# EasyEDA schematic LcsNodes-Extension-GPIO-Board-32-S-B.00.01.json

## Sheets
1 Connectors: TITLE: LcsNodes-Extension-GPIO-Board\nConnectors; REV: B.00.01; Date: 2023-05-06; Sheet: 2/3; Drawn By: helmut-f; Company: Your Company
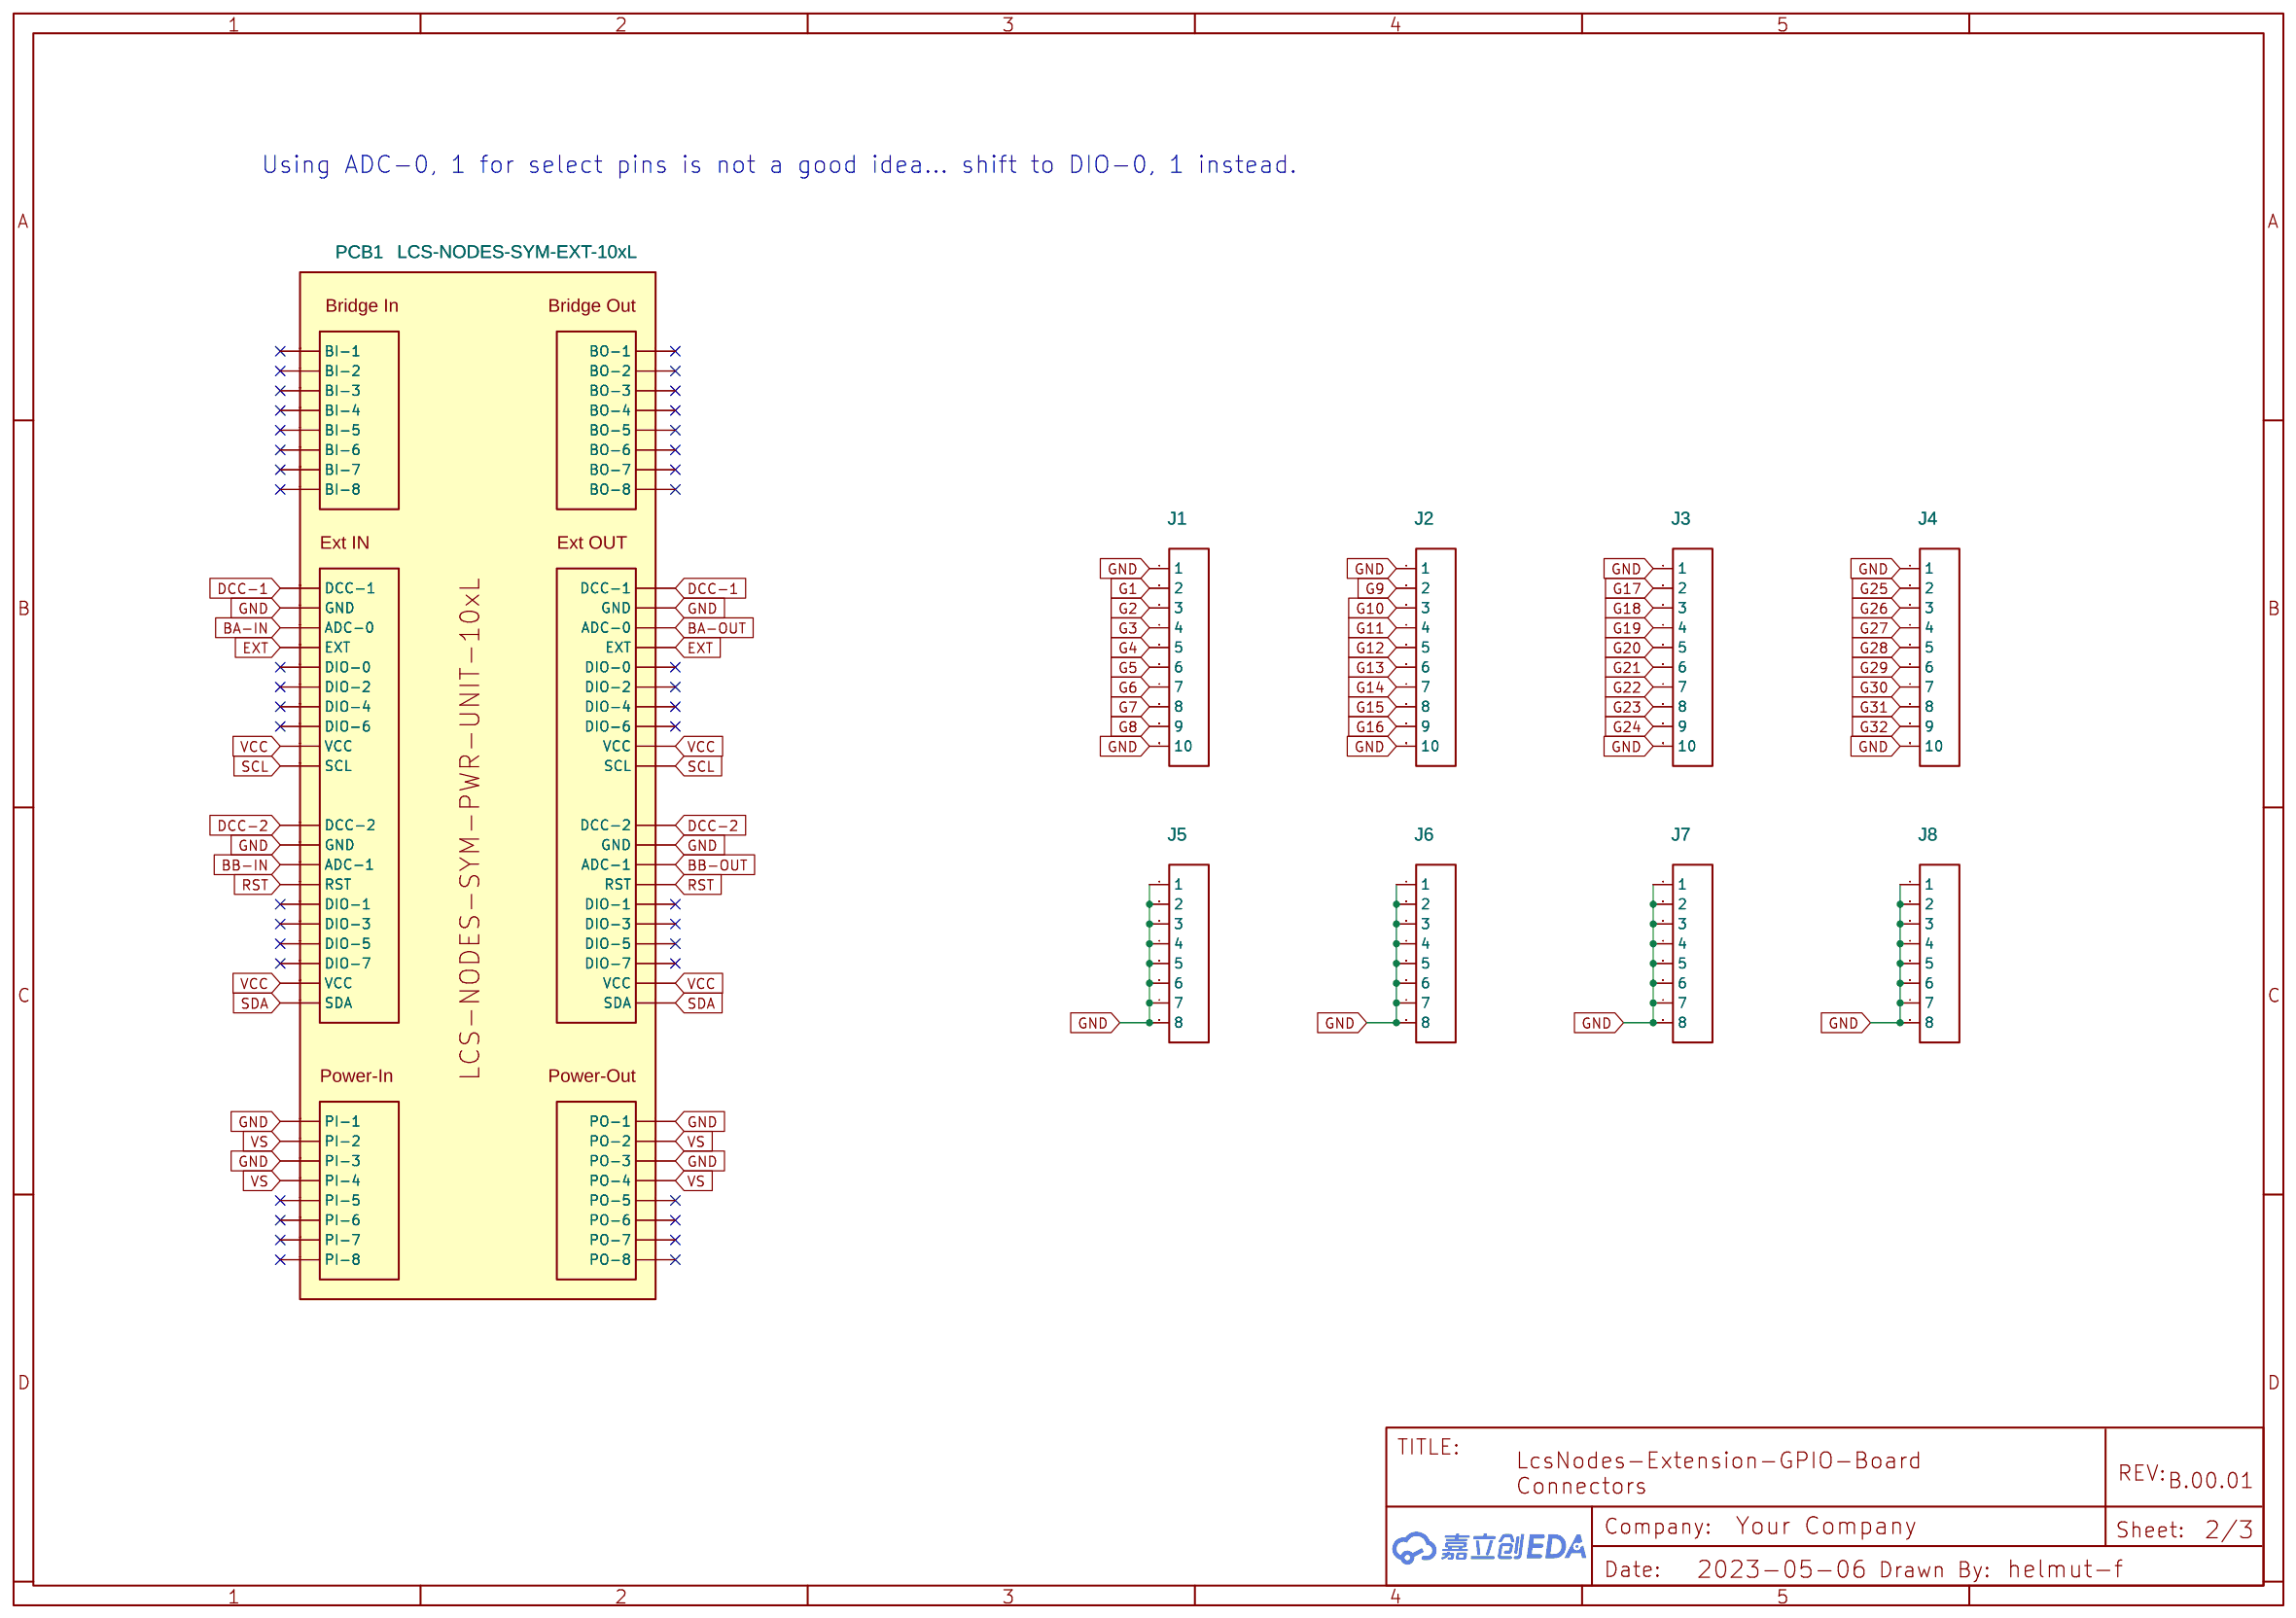
[diagram p0: Connectors]
2 Logic: TITLE: LcsNodes-Extension-GPIO-Board\nLogic; Date: 2023-05-07; Sheet: 3/3
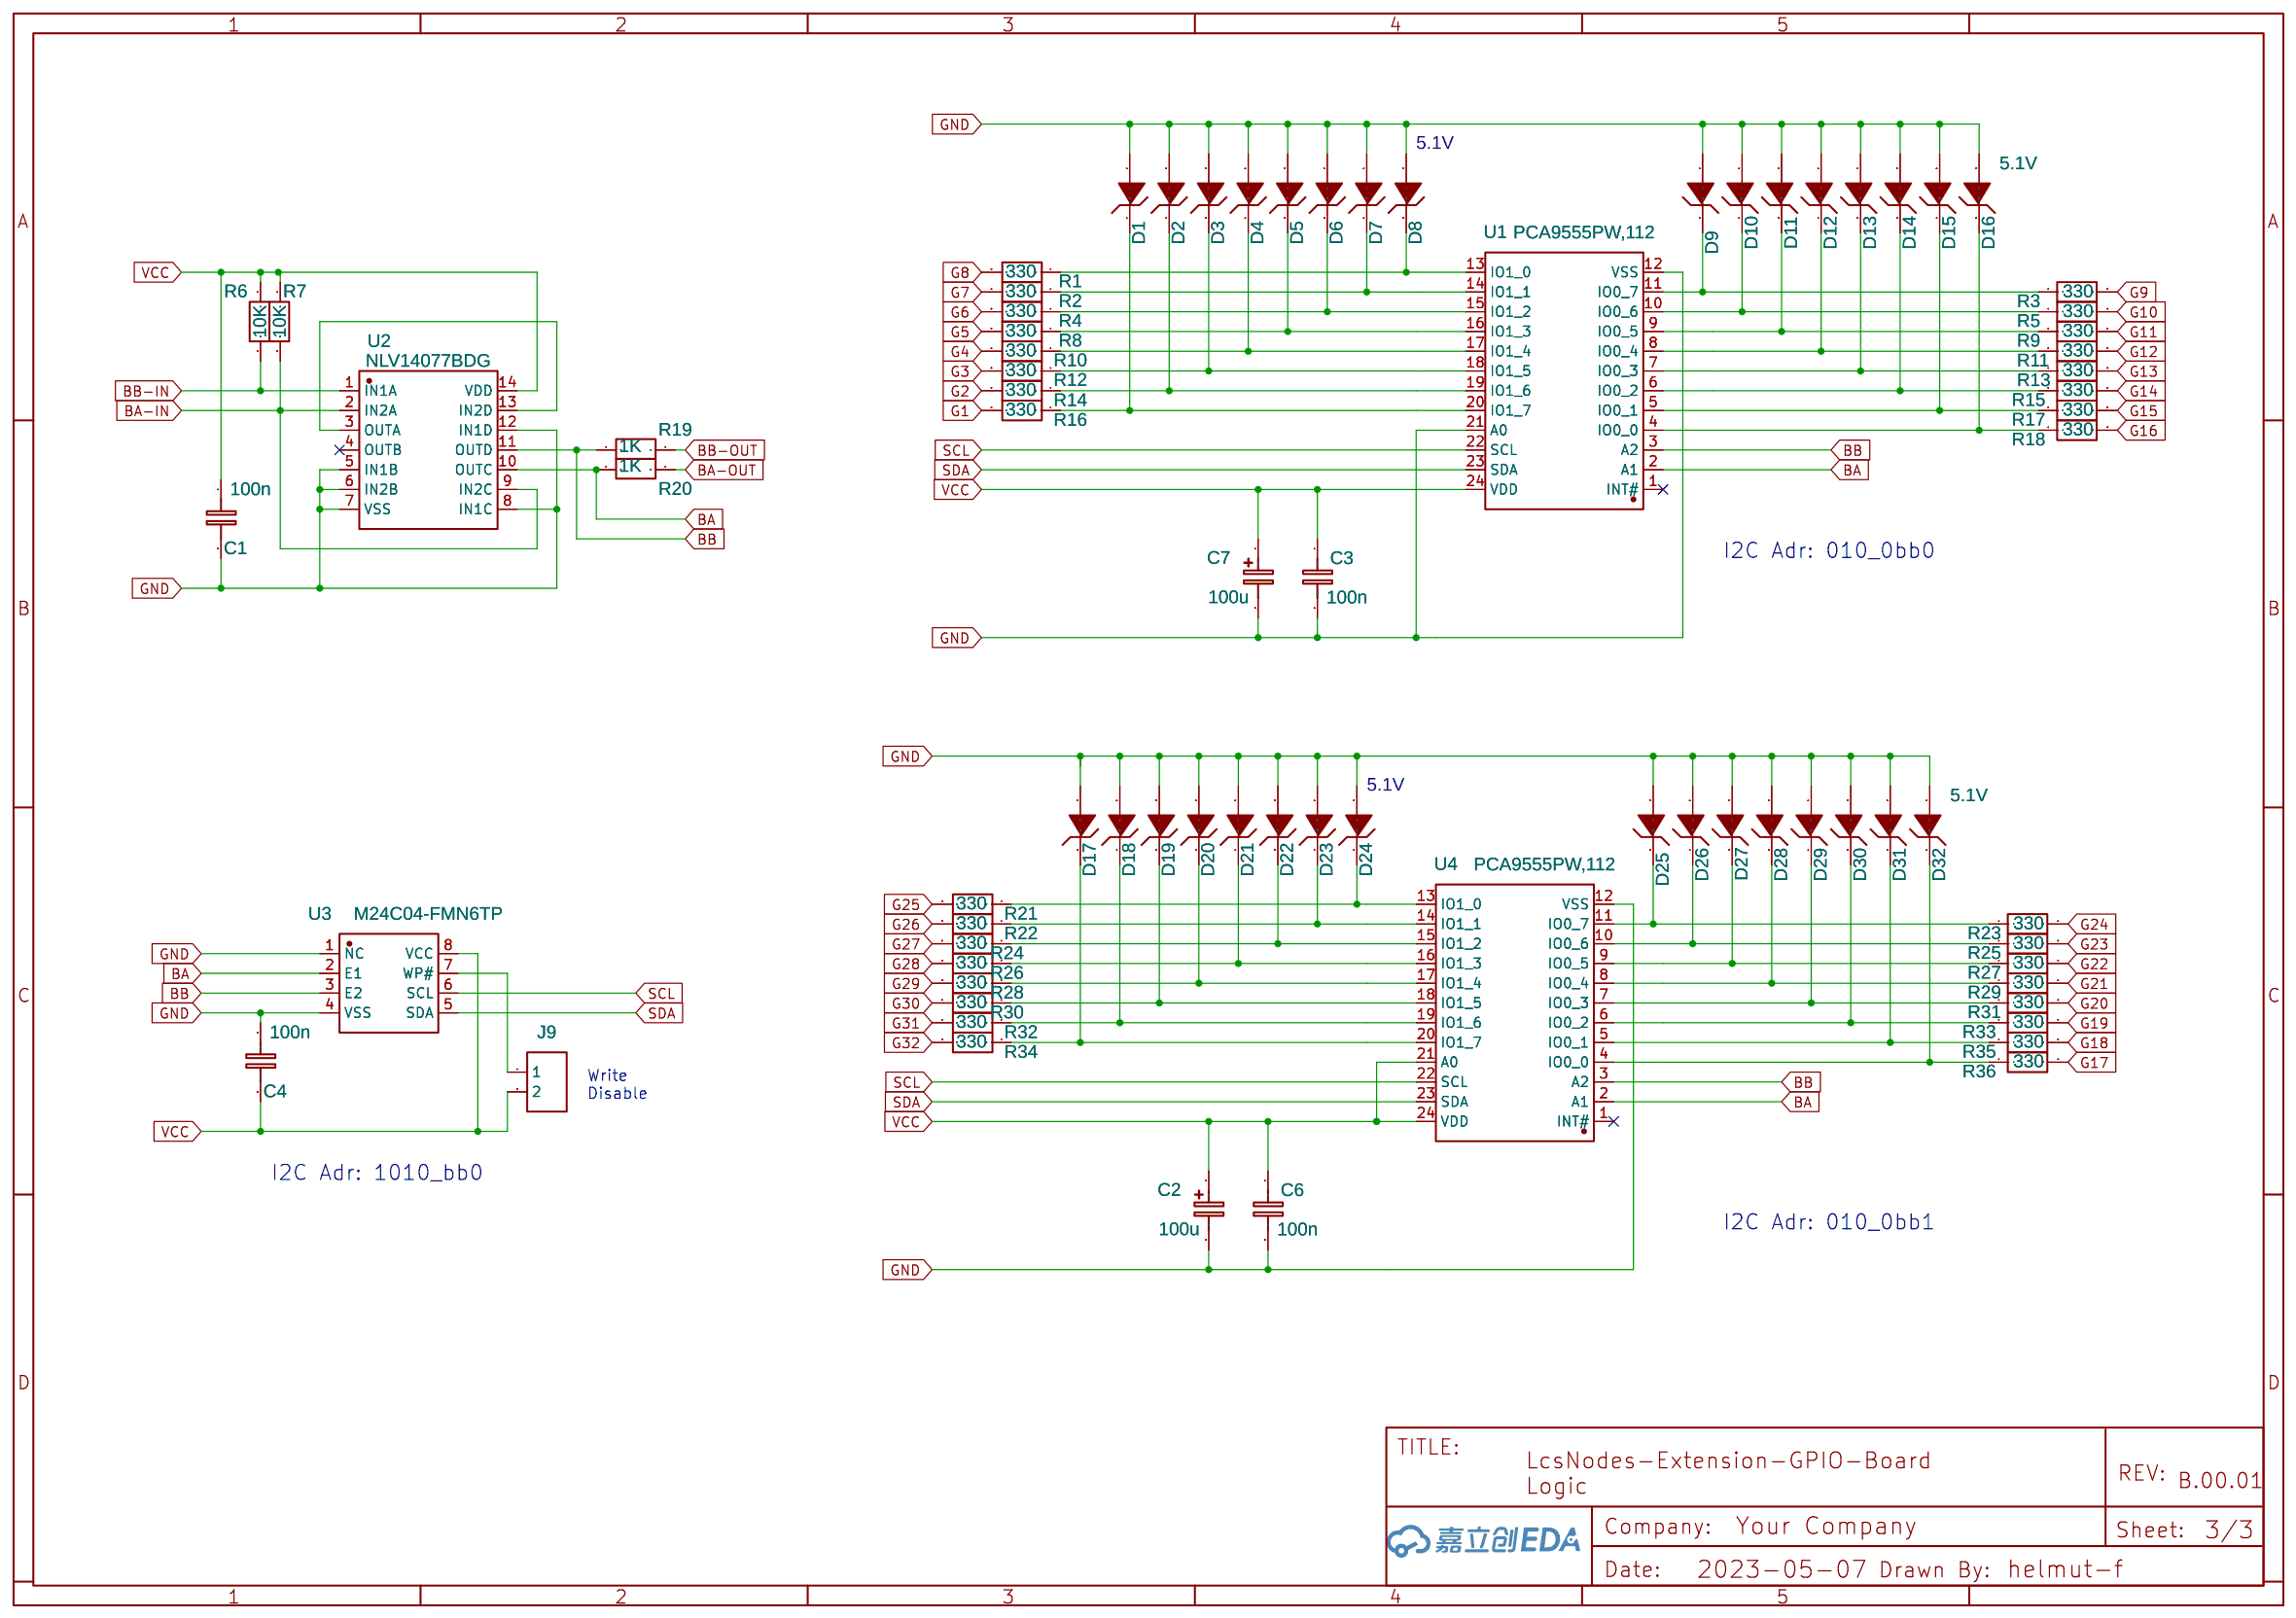
[diagram p1: Logic]
3 High Level Schematic: TITLE: LcsNodes-Extension-GPIO-Board\nHigh Level Schmatic; Date: 2023-02-08; Sheet: 1/3
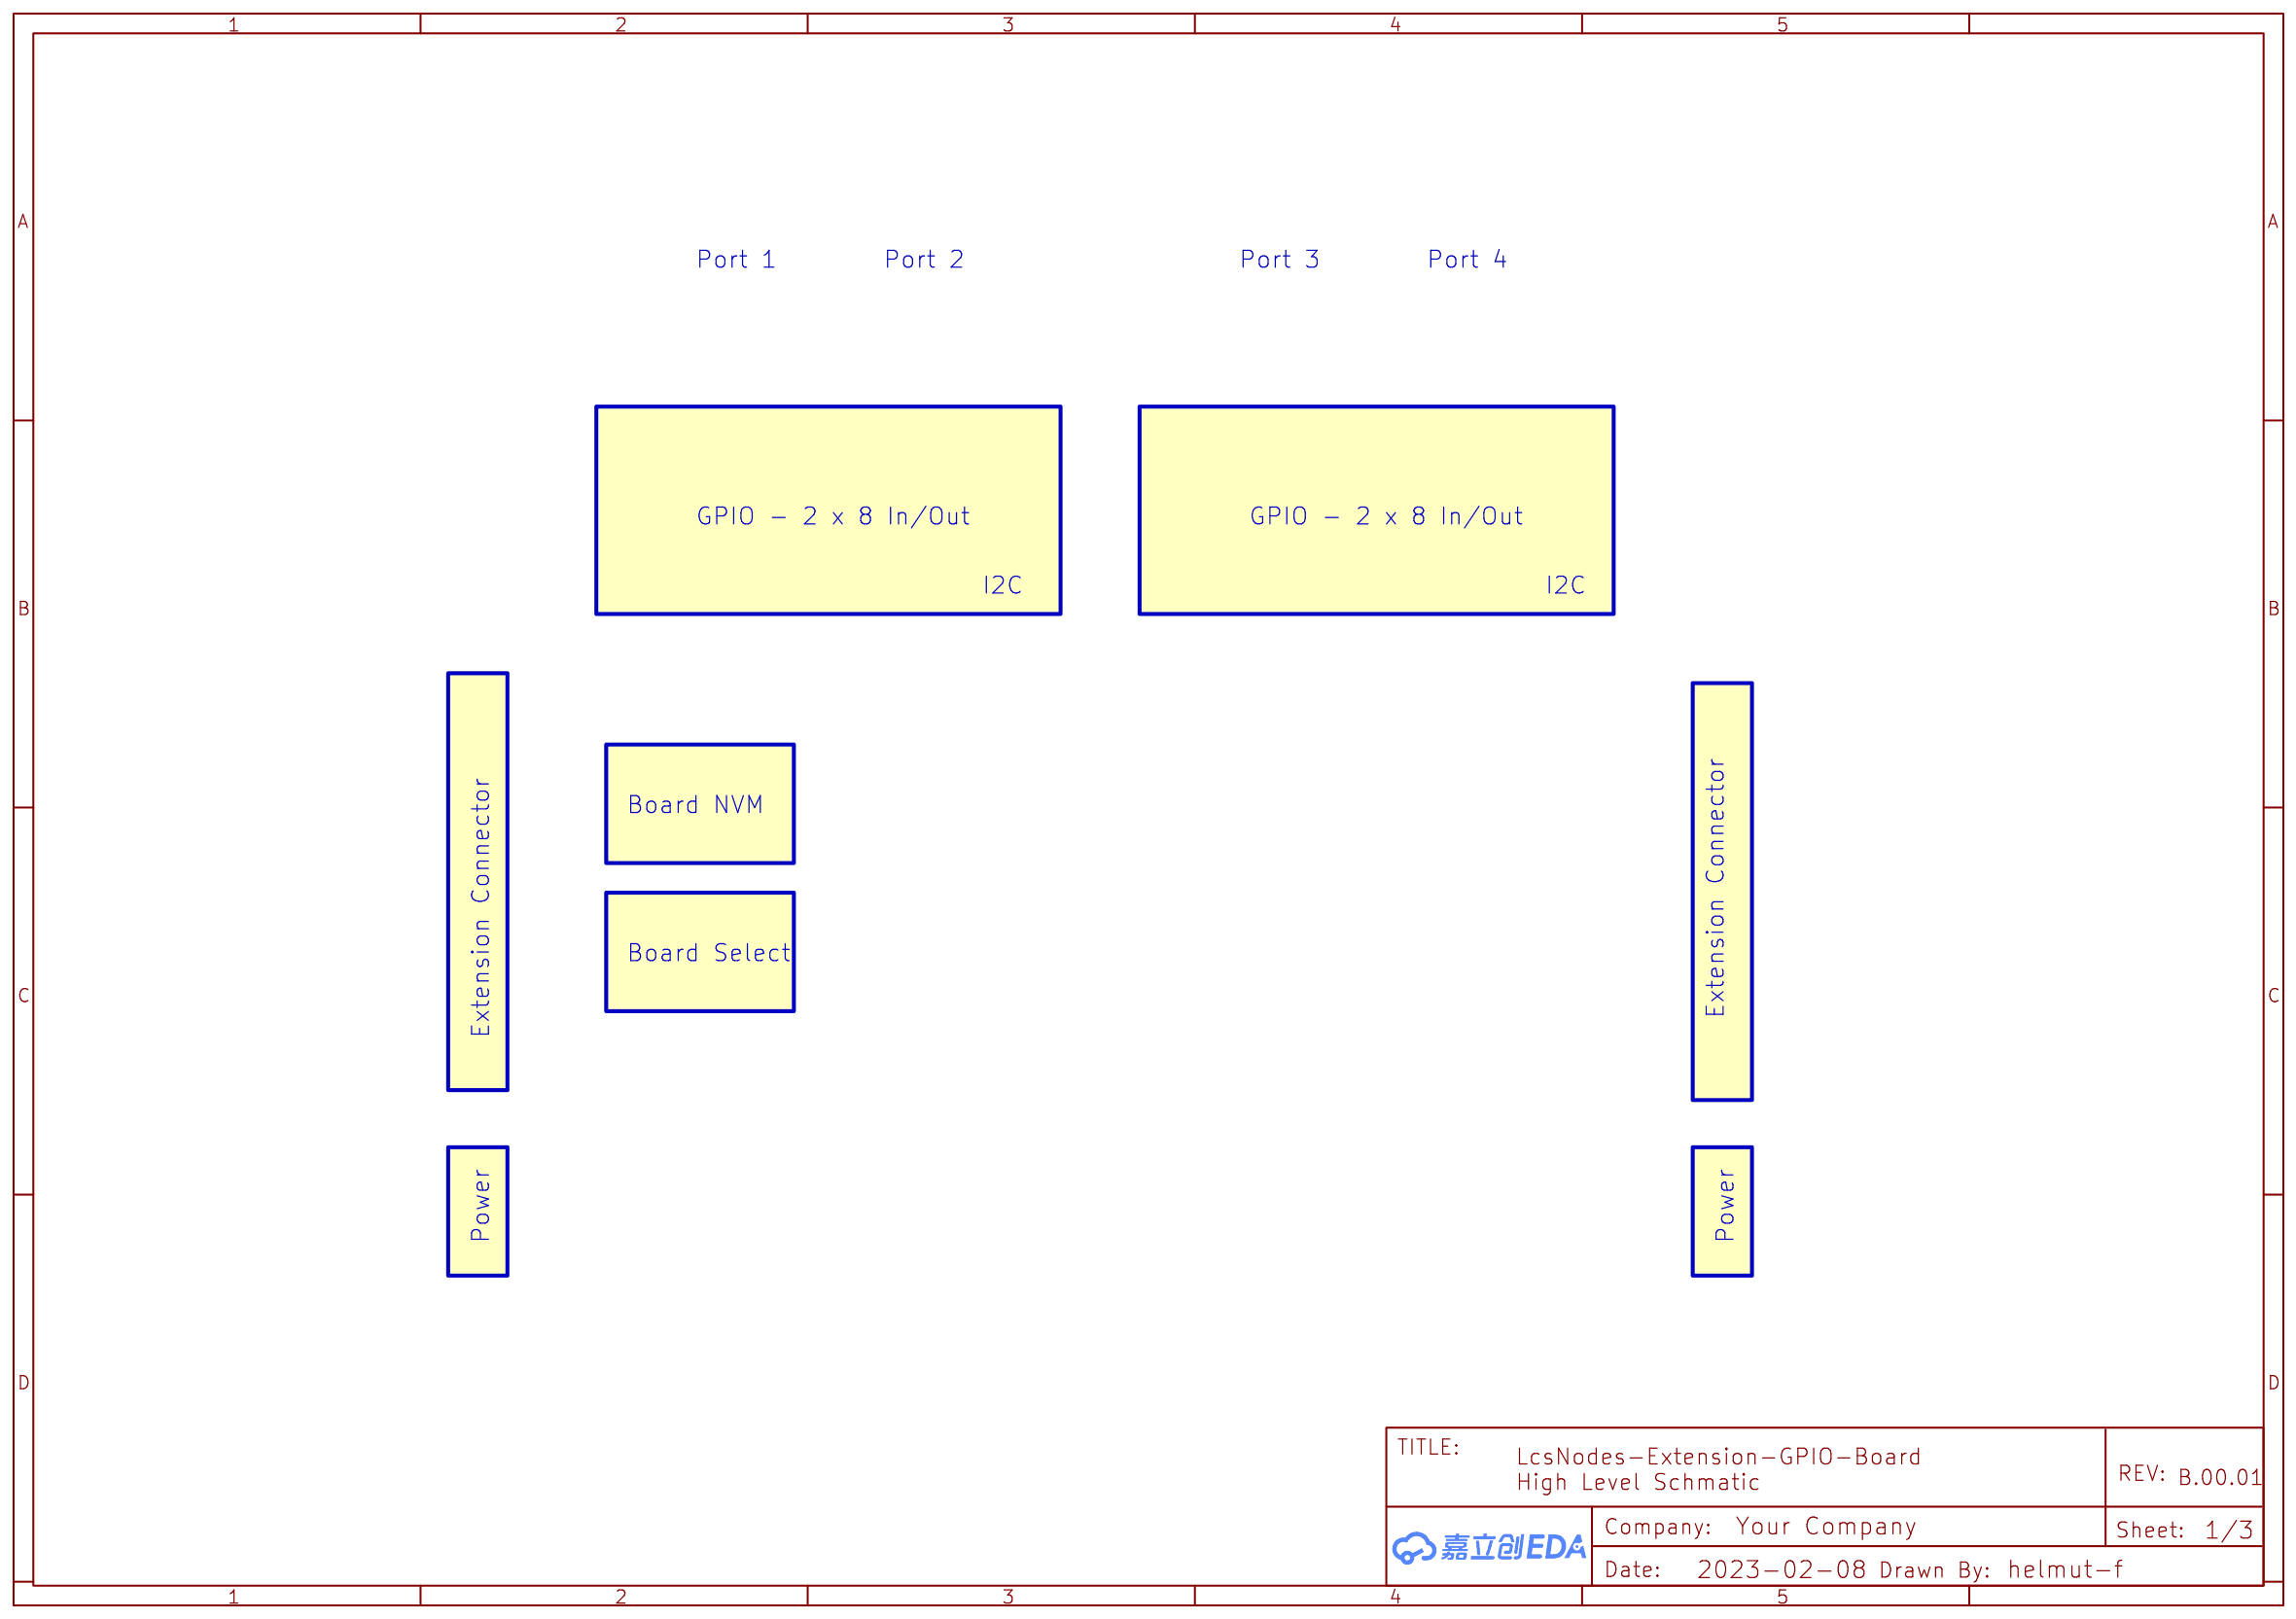
[diagram p2: High Level Schematic]

## Parts
sheet Connectors
J1  HDR-M-2.54_1x10  [HDR-M-2.54_1X10]
J2  HDR-M-2.54_1x10  [HDR-M-2.54_1X10]
J3  HDR-M-2.54_1x10  [HDR-M-2.54_1X10]
J4  HDR-M-2.54_1x10  [HDR-M-2.54_1X10]
J5  HDR-M-2.54_1x8  [HDR-M-2.54_1X8]
J6  HDR-M-2.54_1x8  [HDR-M-2.54_1X8]
J7  HDR-M-2.54_1x8  [HDR-M-2.54_1X8]
J8  HDR-M-2.54_1x8  [HDR-M-2.54_1X8]
PCB1  LCS-NODES-SYM-EXT-10xL  [LCS-NODES-FP-EXT-PCB-10X8]
sheet Logic
C1  100n  [C1206]
C2  100u  [CAP-SMD_BD6.3-L6.6-W6.6-LS7.4-FD]
C3  100n  [C1206]
C4  100n  [C1206]
C6  100n  [C1206]
C7  100u  [CAP-SMD_BD6.3-L6.6-W6.6-LS7.6-FD]
D1  5.1V  [SOD-80C_L3.3-W1.5-RD]
D2  5.1V  [SOD-80C_L3.3-W1.5-RD]
D3  5.1V  [SOD-80C_L3.3-W1.5-RD]
D4  5.1V  [SOD-80C_L3.3-W1.5-RD]
D5  5.1V  [SOD-80C_L3.3-W1.5-RD]
D6  5.1V  [SOD-80C_L3.3-W1.5-RD]
D7  5.1V  [SOD-80C_L3.3-W1.5-RD]
D8  5.1V  [SOD-80C_L3.3-W1.5-RD]
D9  5.1V  [SOD-80C_L3.3-W1.5-RD]
D10  5.1V  [SOD-80C_L3.3-W1.5-RD]
D11  5.1V  [SOD-80C_L3.3-W1.5-RD]
D12  5.1V  [SOD-80C_L3.3-W1.5-RD]
D13  5.1V  [SOD-80C_L3.3-W1.5-RD]
D14  5.1V  [SOD-80C_L3.3-W1.5-RD]
D15  5.1V  [SOD-80C_L3.3-W1.5-RD]
D16  5.1V  [SOD-80C_L3.3-W1.5-RD]
D17  5.1V  [SOD-80C_L3.3-W1.5-RD]
D18  5.1V  [SOD-80C_L3.3-W1.5-RD]
D19  5.1V  [SOD-80C_L3.3-W1.5-RD]
D20  5.1V  [SOD-80C_L3.3-W1.5-RD]
D21  5.1V  [SOD-80C_L3.3-W1.5-RD]
D22  5.1V  [SOD-80C_L3.3-W1.5-RD]
D23  5.1V  [SOD-80C_L3.3-W1.5-RD]
D24  5.1V  [SOD-80C_L3.3-W1.5-RD]
D25  5.1V  [SOD-80C_L3.3-W1.5-RD]
D26  5.1V  [SOD-80C_L3.3-W1.5-RD]
D27  5.1V  [SOD-80C_L3.3-W1.5-RD]
D28  5.1V  [SOD-80C_L3.3-W1.5-RD]
D29  5.1V  [SOD-80C_L3.3-W1.5-RD]
D30  5.1V  [SOD-80C_L3.3-W1.5-RD]
D31  5.1V  [SOD-80C_L3.3-W1.5-RD]
D32  5.1V  [SOD-80C_L3.3-W1.5-RD]
J9  HDR-M-2.54_1x2  [HDR-M-2.54_1X2]
R1  330  [R1206]
R2  330  [R1206]
R3  330  [R1206]
R4  330  [R1206]
R5  330  [R1206]
R6  10K  [R1206]
R7  10K  [R1206]
R8  330  [R1206]
R9  330  [R1206]
R10  330  [R1206]
R11  330  [R1206]
R12  330  [R1206]
R13  330  [R1206]
R14  330  [R1206]
R15  330  [R1206]
R16  330  [R1206]
R17  330  [R1206]
R18  330  [R1206]
R19  1K  [R1206]
R20  1K  [R1206]
R21  330  [R1206]
R22  330  [R1206]
R23  330  [R1206]
R24  330  [R1206]
R25  330  [R1206]
R26  330  [R1206]
R27  330  [R1206]
R28  330  [R1206]
R29  330  [R1206]
R30  330  [R1206]
R31  330  [R1206]
R32  330  [R1206]
R33  330  [R1206]
R34  330  [R1206]
R35  330  [R1206]
R36  330  [R1206]
U1  PCA9555PW,112  [TSSOP-24_L7.8-W4.4-P0.65-LS6.4-BL]
U2  NLV14077BDG  [SOIC-14_L8.7-W3.9-P1.27-LS6.0-BL]
U3  M24C04-FMN6TP  [SOP-8_L5.0-W3.9-P1.27-LS6.0-BL]
U4  PCA9555PW,112  [TSSOP-24_L7.8-W4.4-P0.65-LS6.4-BL]

## Library data of the parts
J1-J4 = HDR-M-2.54_1x10: Supplier Part: C57369; Supplier: LCSC; Contributor: LCEDA_Lib
J5-J8 = HDR-M-2.54_1x8: Supplier Part: C190820; Supplier: LCSC; Contributor: LCEDA_Lib
PCB1 = LCS-NODES-SYM-EXT-10xL: Contributor: helmut-f
C1 C3 C4 C6 = C_0603_EU: Contributor: LCEDA_Lib; Package Display: No
C2 C7 = CE_TH_D4.0×F1.5_EU: Contributor: LCEDA_Lib
D1-D32 = Diode Zener: Supplier: LCSC; Manufacturer: SEMTECH; Supplier Part: C14516; JLCPCB Part Class: Extended Part; Contributor: Arrost
J9 = HDR-M-2.54_1x2: Supplier Part: C124375; Supplier: LCSC; Contributor: LCEDA_Lib
R1-R36 = R_AXIAL-0.3_EU: Contributor: LCEDA_Lib
U1 U4 = PCA9555PW,112: Supplier: LCSC; Supplier Part: C2688893; Manufacturer: NXP(恩智浦); Contributor: LCSC; JLCPCB Part Class: Extended Part
U2 = NLV14077BDG: Supplier: LCSC; Supplier Part: C897321; Manufacturer: onsemi(安森美); Contributor: LCSC; JLCPCB Part Class: Extended Part
U3 = M24C04-FMN6TP: Supplier: LCSC; Supplier Part: C2062025; Manufacturer: ST(意法半导体); Contributor: LCSC; JLCPCB Part Class: Extended Part

## Nets
GND: C1.2 C2.2 C3.2 C4.1 C6.2 C7.2 D1.2(A) D2.2(A) D3.2(A) D4.2(A) D5.2(A) D6.2(A) D7.2(A) D8.2(A) D9.2(A) D10.2(A) D11.2(A) D12.2(A) D13.2(A) D14.2(A) D15.2(A) D16.2(A) D17.2(A) D18.2(A) D19.2(A) D20.2(A) D21.2(A) D22.2(A) D23.2(A) D24.2(A) D25.2(A) D26.2(A) D27.2(A) D28.2(A) D29.2(A) D30.2(A) D31.2(A) D32.2(A) J1.1 J1.10 J2.1 J2.10 J3.1 J3.10 J4.1 J4.10 J5.1 J5.2 J5.3 J5.4 J5.5 J5.6 J5.7 J5.8 J6.1 J6.2 J6.3 J6.4 J6.5 J6.6 J6.7 J6.8 J7.1 J7.2 J7.3 J7.4 J7.5 J7.6 J7.7 J7.8 J8.1 J8.2 J8.3 J8.4 J8.5 J8.6 J8.7 J8.8 PCB1.21(GND) PCB1.31(GND) PCB1.40(PI-1) PCB1.42(PI-3) PCB1.61(GND) PCB1.71(GND) PCB1.80(PO-1) PCB1.82(PO-3) U1.12(VSS) U1.21(A0) U2.5(IN1B) U2.6(IN2B) U2.7(VSS) U2.8(IN1C) U2.12(IN1D) U3.1(NC) U3.4(VSS) U4.12(VSS)
VCC: C1.1 C2.1 C3.1 C4.2 C6.1 C7.1 J9.2 PCB1.28(VCC) PCB1.38(VCC) PCB1.68(VCC) PCB1.78(VCC) R6.1 R7.1 U1.24(VDD) U2.14(VDD) U3.8(VCC) U4.21(A0) U4.24(VDD)
BA: R20.2 U1.2(A1) U2.10(OUTC) U3.2(E1) U4.2(A1)
BA-IN: PCB1.22(ADC-0) R7.2 U2.2(IN2A) U2.9(IN2C)
BA-OUT: PCB1.62(ADC-0) R20.1
BB: R19.2 U1.3(A2) U2.11(OUTD) U3.3(E2) U4.3(A2)
BB-IN: PCB1.32(ADC-1) R6.2 U2.1(IN1A)
BB-OUT: PCB1.72(ADC-1) R19.1
DCC-1: PCB1.20(DCC-1) PCB1.60(DCC-1)
DCC-2: PCB1.30(DCC-2) PCB1.70(DCC-2)
EXT: PCB1.23(EXT) PCB1.63(EXT)
G1: J1.2 R16.2
G2: J1.3 R14.2
G3: J1.4 R12.2
G4: J1.5 R10.2
G5: J1.6 R8.2
G6: J1.7 R4.2
G7: J1.8 R2.2
G8: J1.9 R1.2
G9: J2.2 R3.2
G10: J2.3 R5.2
G11: J2.4 R9.2
G12: J2.5 R11.2
G13: J2.6 R13.2
G14: J2.7 R15.2
G15: J2.8 R17.2
G16: J2.9 R18.2
G17: J3.2 R36.2
G18: J3.3 R35.2
G19: J3.4 R33.2
G20: J3.5 R31.2
G21: J3.6 R29.2
G22: J3.7 R27.2
G23: J3.8 R25.2
G24: J3.9 R23.2
G25: J4.2 R21.2
G26: J4.3 R22.2
G27: J4.4 R24.2
G28: J4.5 R26.2
G29: J4.6 R28.2
G30: J4.7 R30.2
G31: J4.8 R32.2
G32: J4.9 R34.2
RST: PCB1.33(RST) PCB1.73(RST)
SCL: PCB1.29(SCL) PCB1.69(SCL) U1.22(SCL) U3.6(SCL) U4.22(SCL)
SDA: PCB1.39(SDA) PCB1.79(SDA) U1.23(SDA) U3.5(SDA) U4.23(SDA)
VS: PCB1.41(PI-2) PCB1.43(PI-4) PCB1.81(PO-2) PCB1.83(PO-4)
Net-(D1-1): D1.1(C) R16.1 U1.20(IO1_7)
Net-(D2-1): D2.1(C) R14.1 U1.19(IO1_6)
Net-(D3-1): D3.1(C) R12.1 U1.18(IO1_5)
Net-(D4-1): D4.1(C) R10.1 U1.17(IO1_4)
Net-(D5-1): D5.1(C) R8.1 U1.16(IO1_3)
Net-(D6-1): D6.1(C) R4.1 U1.15(IO1_2)
Net-(D7-1): D7.1(C) R2.1 U1.14(IO1_1)
Net-(D8-1): D8.1(C) R1.1 U1.13(IO1_0)
Net-(D9-1): D9.1(C) R3.1 U1.11(IO0_7)
Net-(D10-1): D10.1(C) R5.1 U1.10(IO0_6)
Net-(D11-1): D11.1(C) R9.1 U1.9(IO0_5)
Net-(D12-1): D12.1(C) R11.1 U1.8(IO0_4)
Net-(D13-1): D13.1(C) R13.1 U1.7(IO0_3)
Net-(D14-1): D14.1(C) R15.1 U1.6(IO0_2)
Net-(D15-1): D15.1(C) R17.1 U1.5(IO0_1)
Net-(D16-1): D16.1(C) R18.1 U1.4(IO0_0)
Net-(D17-1): D17.1(C) R34.1 U4.20(IO1_7)
Net-(D18-1): D18.1(C) R32.1 U4.19(IO1_6)
Net-(D19-1): D19.1(C) R30.1 U4.18(IO1_5)
Net-(D20-1): D20.1(C) R28.1 U4.17(IO1_4)
Net-(D21-1): D21.1(C) R26.1 U4.16(IO1_3)
Net-(D22-1): D22.1(C) R24.1 U4.15(IO1_2)
Net-(D23-1): D23.1(C) R22.1 U4.14(IO1_1)
Net-(D24-1): D24.1(C) R21.1 U4.13(IO1_0)
Net-(D25-1): D25.1(C) R23.1 U4.11(IO0_7)
Net-(D26-1): D26.1(C) R25.1 U4.10(IO0_6)
Net-(D27-1): D27.1(C) R27.1 U4.9(IO0_5)
Net-(D28-1): D28.1(C) R29.1 U4.8(IO0_4)
Net-(D29-1): D29.1(C) R31.1 U4.7(IO0_3)
Net-(D30-1): D30.1(C) R33.1 U4.6(IO0_2)
Net-(D31-1): D31.1(C) R35.1 U4.5(IO0_1)
Net-(D32-1): D32.1(C) R36.1 U4.4(IO0_0)
Net-(J9-1): J9.1 U3.7(WP#)
Net-(U2-3): U2.3(OUTA) U2.13(IN2D)

Not connected (* = marked no-connect by the designer): PCB1 10(BI-1)* 11(BI-2)* 12(BI-3)* 13(BI-4)* 14(BI-5)* 15(BI-6)* 16(BI-7)* 17(BI-8)* 24(DIO-0)* 25(DIO-2)* 26(DIO-4)* 27(DIO-6)* 34(DIO-1)* 35(DIO-3)* 36(DIO-5)* 37(DIO-7)* 44(PI-5)* 45(PI-6)* 46(PI-7)* 47(PI-8)* 50(BO-1)* 51(BO-2)* 52(BO-3)* 53(BO-4)* 54(BO-5)* 55(BO-6)* 56(BO-7)* 57(BO-8)* 64(DIO-0)* 65(DIO-2)* 66(DIO-4)* 67(DIO-6)* 74(DIO-1)* 75(DIO-3)* 76(DIO-5)* 77(DIO-7)* 84(PO-5)* 85(PO-6)* 86(PO-7)* 87(PO-8)*; U1 1(INT#)*; U2 4(OUTB)*; U4 1(INT#)*

## Notes on the sheets
sheet 1
- Using ADC-0, 1 for select pins is not a good idea... shift to DIO-0, 1 instead.
sheet 2
- 5.1V
- I2C Adr: 010_0bb0
- 5.1V
- Write
  Disable
- I2C Adr: 1010_bb0
- I2C Adr: 010_0bb1
sheet 3
- Port 1
- Port 2
- Port 3
- Port 4
- GPIO - 2 x 8 In/Out
- GPIO - 2 x 8 In/Out
- I2C
- I2C
- Board NVM
- Board Select
- Extension Connector
- Extension Connector
- Power
- Power
